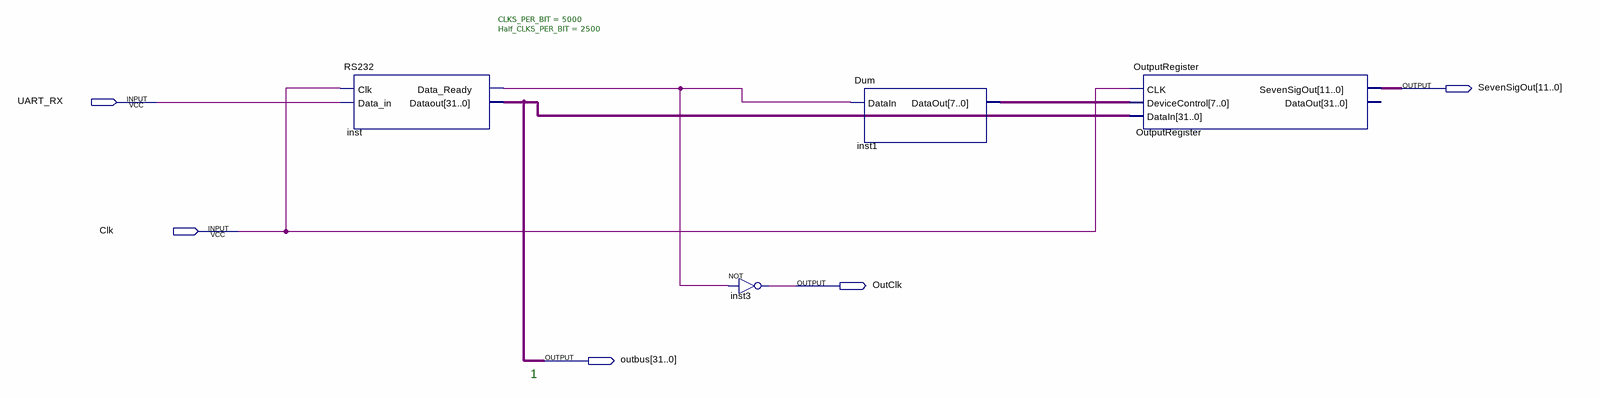
[diagram p0: schematic sheet]
// Quartus schematic RS232_TestBranch.bdf as structural Verilog: 4 symbols, 5 pins
module RS232_TestBranch (
  input  UART_RX,
  input  Clk,
  output [11:0] SevenSigOut,
  output OutClk,
  output [31:0] outbus
);

  wire inst_data_ready;
  wire [7:0] inst1_dataout;

  RS232 #(.CLKS_PER_BIT(5000), .Half_CLKS_PER_BIT(2500)) inst (
    .Clk(Clk), .Data_in(UART_RX), .Data_Ready(inst_data_ready), .Dataout(outbus));
  not inst3 (OutClk, inst_data_ready);
  Dum inst1 (.DataIn(inst_data_ready), .DataOut(inst1_dataout));
  OutputRegister OutputRegister (
    .CLK(Clk), .DeviceControl(inst1_dataout), .DataIn(outbus), .SevenSigOut(SevenSigOut));  // open: DataOut

  // Notes on the sheet:
  //   1
endmodule
